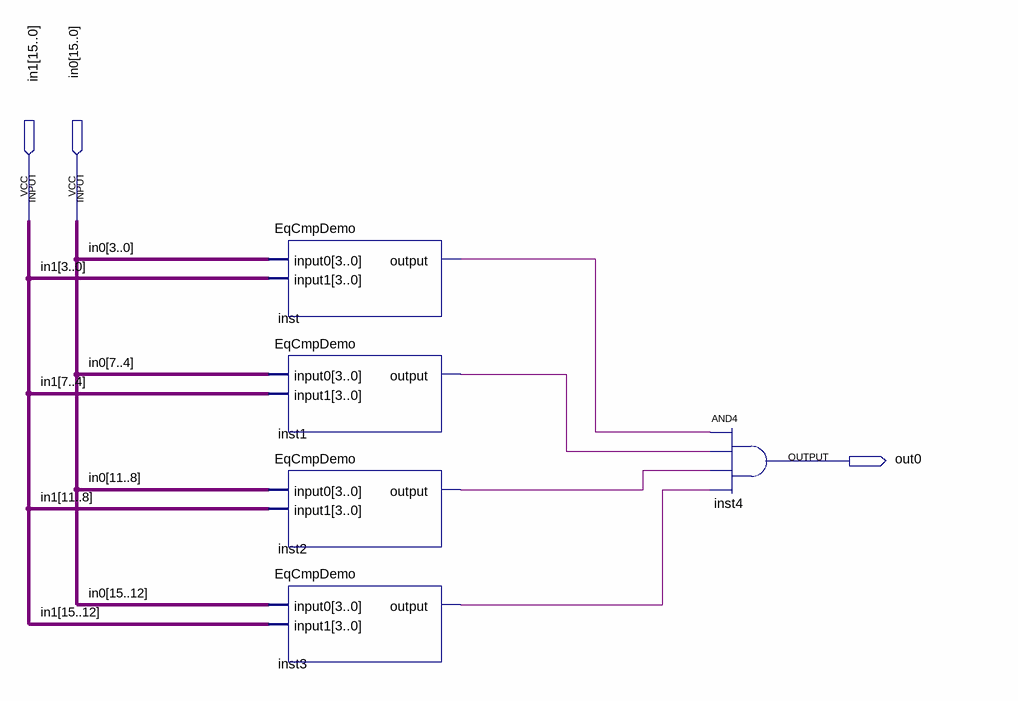
[diagram p0: schematic sheet]
// Quartus schematic EqCmp16Demo.bdf as structural Verilog: 5 symbols, 3 pins
module EqCmp16Demo (
  input  [15:0] in1,
  input  [15:0] in0,
  output out0
);

  wire inst1_output, inst2_output, inst3_output, inst_output;

  EqCmpDemo inst (.input0(in0[3:0]), .input1(in1[3:0]), .\output (inst_output));
  EqCmpDemo inst1 (.input0(in0[7:4]), .input1(in1[7:4]), .\output (inst1_output));
  EqCmpDemo inst2 (.input0(in0[11:8]), .input1(in1[11:8]), .\output (inst2_output));
  EqCmpDemo inst3 (.input0(in0[15:12]), .input1(in1[15:12]), .\output (inst3_output));
  and inst4 (out0, inst_output, inst1_output, inst2_output, inst3_output);
endmodule
